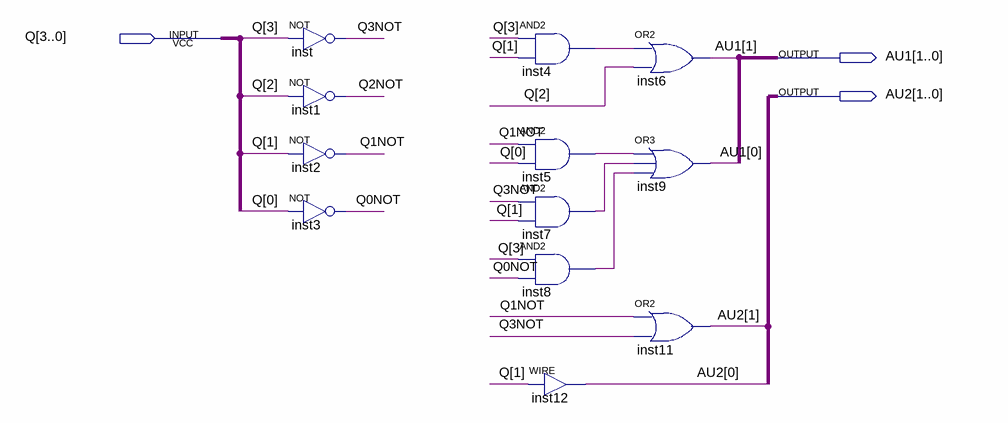
[diagram p0: schematic sheet]
// Quartus schematic DECODE_AU.bdf as structural Verilog: 12 symbols, 3 pins
module DECODE_AU (
  input  [3:0] Q,
  output [1:0] AU1,
  output [1:0] AU2
);

  wire inst4_out, inst5_out, inst7_out, inst8_out, Q0NOT, Q1NOT, Q2NOT, Q3NOT;

  not inst (Q3NOT, Q[3]);
  not inst1 (Q2NOT, Q[2]);
  not inst2 (Q1NOT, Q[1]);
  not inst3 (Q0NOT, Q[0]);
  and inst4 (inst4_out, Q[3], Q[1]);
  and inst5 (inst5_out, Q1NOT, Q[0]);
  and inst7 (inst7_out, Q3NOT, Q[1]);
  and inst8 (inst8_out, Q[3], Q0NOT);
  assign AU2[0] = Q[1];  // WIRE inst12
  or inst6 (AU1[1], inst4_out, Q[2]);
  or inst9 (AU1[0], inst5_out, inst7_out, inst8_out);
  or inst11 (AU2[1], Q1NOT, Q3NOT);
endmodule
